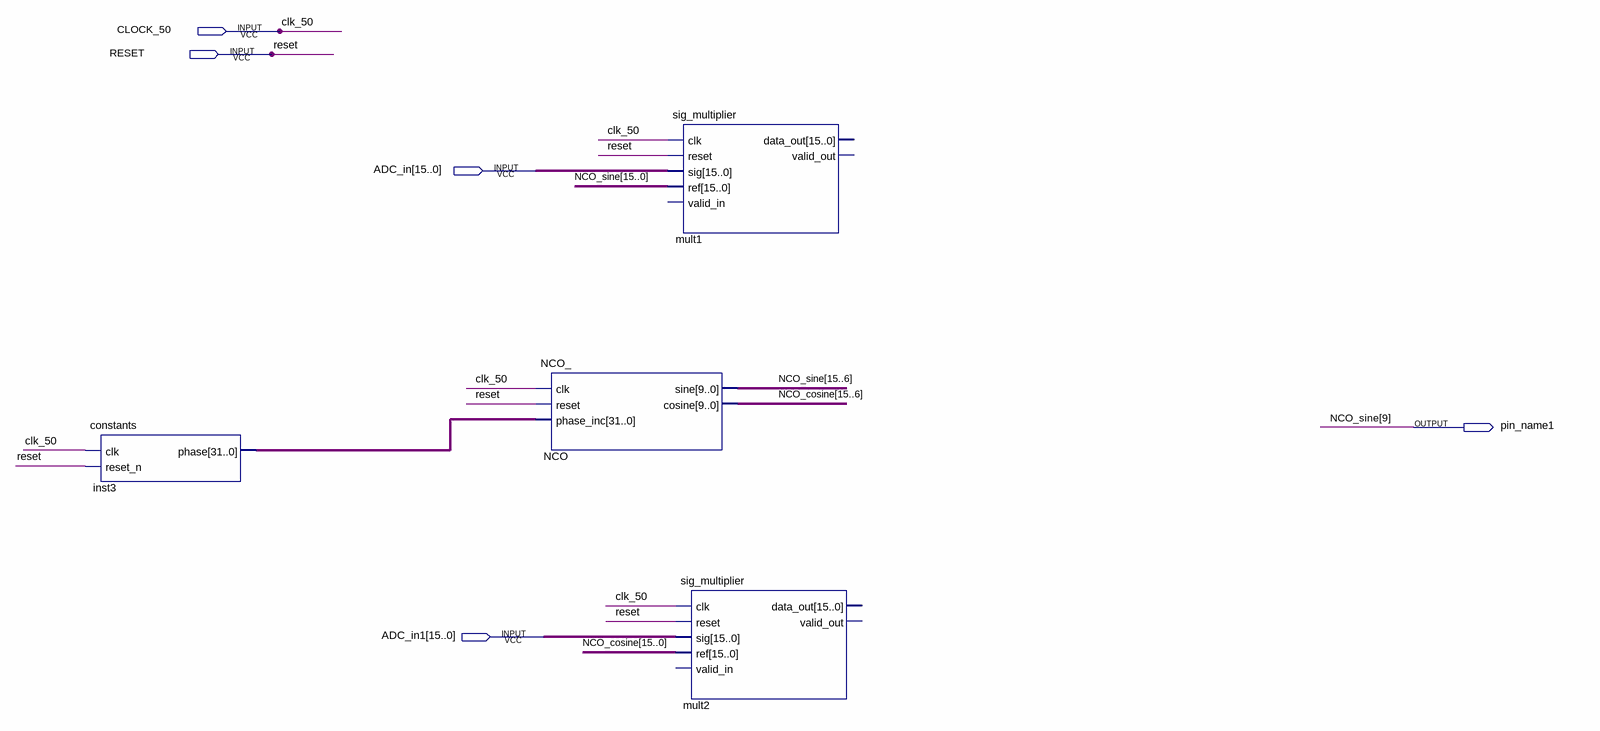
[diagram p0: schematic sheet]
// Quartus schematic Lock_in.bdf as structural Verilog: 4 symbols, 5 pins
module Lock_in (
  input  CLOCK_50,
  input  RESET,
  input  [15:0] ADC_in,
  input  [15:0] ADC_in1,
  output pin_name1
);

  wire [15:0] NCO_cosine, NCO_sine;
  wire [31:0] inst3_phase;

  constants inst3 (.clk(CLOCK_50), .reset_n(RESET), .phase(inst3_phase));
  NCO_ NCO (
    .clk(CLOCK_50), .reset(RESET), .phase_inc(inst3_phase),
    .sine({NCO_sine[15:10], pin_name1, NCO_sine[8:6]}), .cosine(NCO_cosine[15:6]));
  sig_multiplier mult1 (
    .clk(CLOCK_50), .reset(RESET), .sig(ADC_in), .\ref ({NCO_sine[15:10], pin_name1, NCO_sine[8:0]}));  // open: valid_in, data_out, valid_out
  sig_multiplier mult2 (
    .clk(CLOCK_50), .reset(RESET), .sig(ADC_in1), .\ref (NCO_cosine));  // open: valid_in, data_out, valid_out

  // Other names for the same wires on the sheet: clk_50 = CLOCK_50; NCO_sine[9] = pin_name1
endmodule
